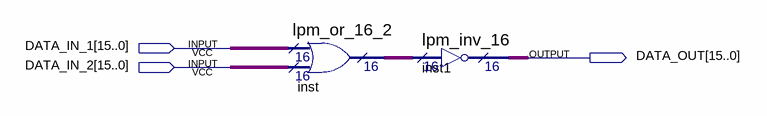
[diagram p0: schematic sheet]
// Quartus schematic oper_nor.bdf as structural Verilog: 2 symbols, 3 pins
module oper_nor (
  input  [15:0] DATA_IN_1,
  input  [15:0] DATA_IN_2,
  output [15:0] DATA_OUT
);

  wire [15:0] inst_result;

  lpm_or_16_2 inst (.data0x(DATA_IN_1), .data1x(DATA_IN_2), .result(inst_result));
  lpm_inv_16 inst1 (.data(inst_result), .result(DATA_OUT));
endmodule
